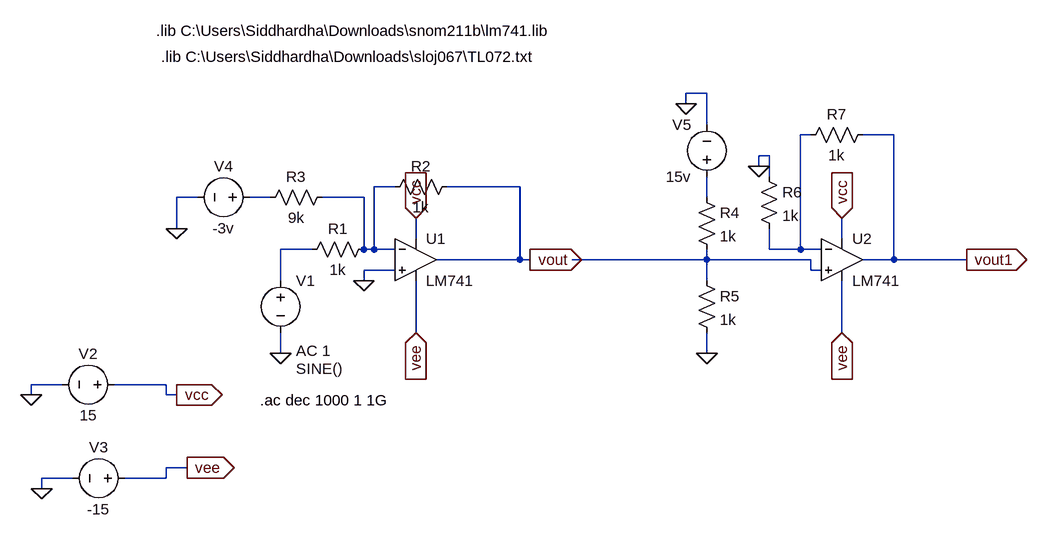
[diagram p0: schematic project_circuit-1 (1) (1).asc]
project_circuit-1 (1) (1).asc, the LTspice schematic file:
Version 4
SHEET 1 1164 680
WIRE 640 -96 608 -96
WIRE 608 -80 608 -96
WIRE 640 -48 640 -96
WIRE 800 -32 784 -32
WIRE 928 -32 880 -32
WIRE 736 0 720 0
WIRE 720 16 720 0
WIRE 736 32 736 0
WIRE 160 48 128 48
WIRE 352 48 240 48
WIRE -144 64 -176 64
WIRE -32 64 -64 64
WIRE 112 64 48 64
WIRE 640 64 640 32
WIRE -176 112 -176 64
WIRE 192 128 192 96
WIRE 848 128 848 96
WIRE 32 144 -16 144
WIRE 112 144 112 64
WIRE 128 144 128 48
WIRE 128 144 112 144
WIRE 160 144 128 144
WIRE 736 144 736 112
WIRE 784 144 784 -32
WIRE 784 144 736 144
WIRE 816 144 784 144
WIRE 352 160 352 48
WIRE 352 160 224 160
WIRE 368 160 352 160
WIRE 640 160 640 144
WIRE 640 160 432 160
WIRE 800 160 640 160
WIRE 928 160 928 -32
WIRE 928 160 880 160
WIRE 1040 160 928 160
WIRE 160 176 112 176
WIRE 800 176 800 160
WIRE 816 176 800 176
WIRE -16 192 -16 144
WIRE 112 192 112 176
WIRE 640 192 640 160
WIRE 192 272 192 192
WIRE 848 272 848 192
WIRE -16 304 -16 272
WIRE 640 304 640 272
WIRE -352 352 -400 352
WIRE -192 352 -272 352
WIRE -400 368 -400 352
WIRE -192 368 -192 352
WIRE -176 368 -192 368
WIRE -160 480 -192 480
WIRE -336 496 -384 496
WIRE -192 496 -192 480
WIRE -192 496 -256 496
WIRE -384 512 -384 496
FLAG -16 304 0
FLAG 112 192 0
FLAG 192 272 vee
IOPIN 192 272 In
FLAG 192 96 vcc
IOPIN 192 96 In
FLAG -160 480 vee
IOPIN -160 480 Out
FLAG -176 368 vcc
IOPIN -176 368 Out
FLAG -400 368 0
FLAG -384 512 0
FLAG 368 160 vout
IOPIN 368 160 Out
FLAG -176 112 0
FLAG 848 272 vee
IOPIN 848 272 In
FLAG 848 96 vcc
IOPIN 848 96 In
FLAG 640 304 0
FLAG 608 -80 0
FLAG 720 16 0
FLAG 1040 160 vout1
IOPIN 1040 160 Out
SYMBOL OpAmps\\opamp2 192 96 R0
SYMATTR InstName U1
SYMATTR Value LM741
SYMBOL voltage -16 176 R0
WINDOW 3 24 152 Left 2
WINDOW 123 24 124 Left 2
WINDOW 39 0 0 Left 0
SYMATTR Value SINE()
SYMATTR Value2 AC 1
SYMATTR InstName V1
SYMBOL res 128 128 R90
WINDOW 0 0 56 VBottom 2
WINDOW 3 32 56 VTop 2
SYMATTR InstName R1
SYMATTR Value 1k
SYMBOL res 256 32 R90
WINDOW 0 0 56 VBottom 2
WINDOW 3 32 56 VTop 2
SYMATTR InstName R2
SYMATTR Value 1k
SYMBOL voltage -256 352 R90
WINDOW 0 -32 56 VBottom 2
WINDOW 3 32 56 VTop 2
SYMATTR InstName V2
SYMATTR Value 15
SYMBOL voltage -240 496 R90
WINDOW 0 -32 56 VBottom 2
WINDOW 3 32 56 VTop 2
SYMATTR InstName V3
SYMATTR Value -15
SYMBOL voltage -48 64 R90
WINDOW 0 -32 56 VBottom 2
WINDOW 3 32 56 VTop 2
SYMATTR InstName V4
SYMATTR Value -3v
SYMBOL res 64 48 R90
WINDOW 0 0 56 VBottom 2
WINDOW 3 32 56 VTop 2
SYMATTR InstName R3
SYMATTR Value 9k
SYMBOL OpAmps\\opamp2 848 96 R0
SYMATTR InstName U2
SYMATTR Value LM741
SYMBOL res 624 48 R0
SYMATTR InstName R4
SYMATTR Value 1k
SYMBOL res 624 176 R0
SYMATTR InstName R5
SYMATTR Value 1k
SYMBOL voltage 640 48 R180
WINDOW 0 24 96 Left 2
WINDOW 3 24 16 Left 2
SYMATTR InstName V5
SYMATTR Value 15v
SYMBOL res 720 16 R0
SYMATTR InstName R6
SYMATTR Value 1k
SYMBOL res 896 -48 R90
WINDOW 0 0 56 VBottom 2
WINDOW 3 32 56 VTop 2
SYMATTR InstName R7
SYMATTR Value 1k
TEXT -200 -152 Left 2 !.lib C:\\Users\\Siddhardha\\Downloads\\sloj067\\TL072.txt
TEXT -48 376 Left 2 !.ac dec 1000 1 1G
TEXT -208 -192 Left 2 !.lib C:\\Users\\Siddhardha\\Downloads\\snom211b\\lm741.lib

The netlist it stands for:
* project_circuit-1 (1) (1).asc
XU1 0 N002 vcc vee vout LM741  ; pins In+ In- V+ V- OUT
V1 N005 0 SINE() AC 1
R1 N002 N005 1k
R2 vout N002 1k
V2 vcc 0 15
V3 vee 0 -15
V4 N003 0 -3v
R3 N002 N003 9k
XU2 N006 N001 vcc vee vout1 LM741  ; pins In+ In- V+ V- OUT
R4 N004 N006 1k
R5 N006 0 1k
V5 N004 0 15v
R6 0 N001 1k
R7 vout1 N001 1k
.lib C:\Users\Siddhardha\Downloads\sloj067\TL072.txt
.ac dec 1000 1 1G
.lib C:\Users\Siddhardha\Downloads\snom211b\lm741.lib
.backanno
.end